# EAGLE design relayChain5 (EAGLE 9.2.2)

## Sheet 1 of 2
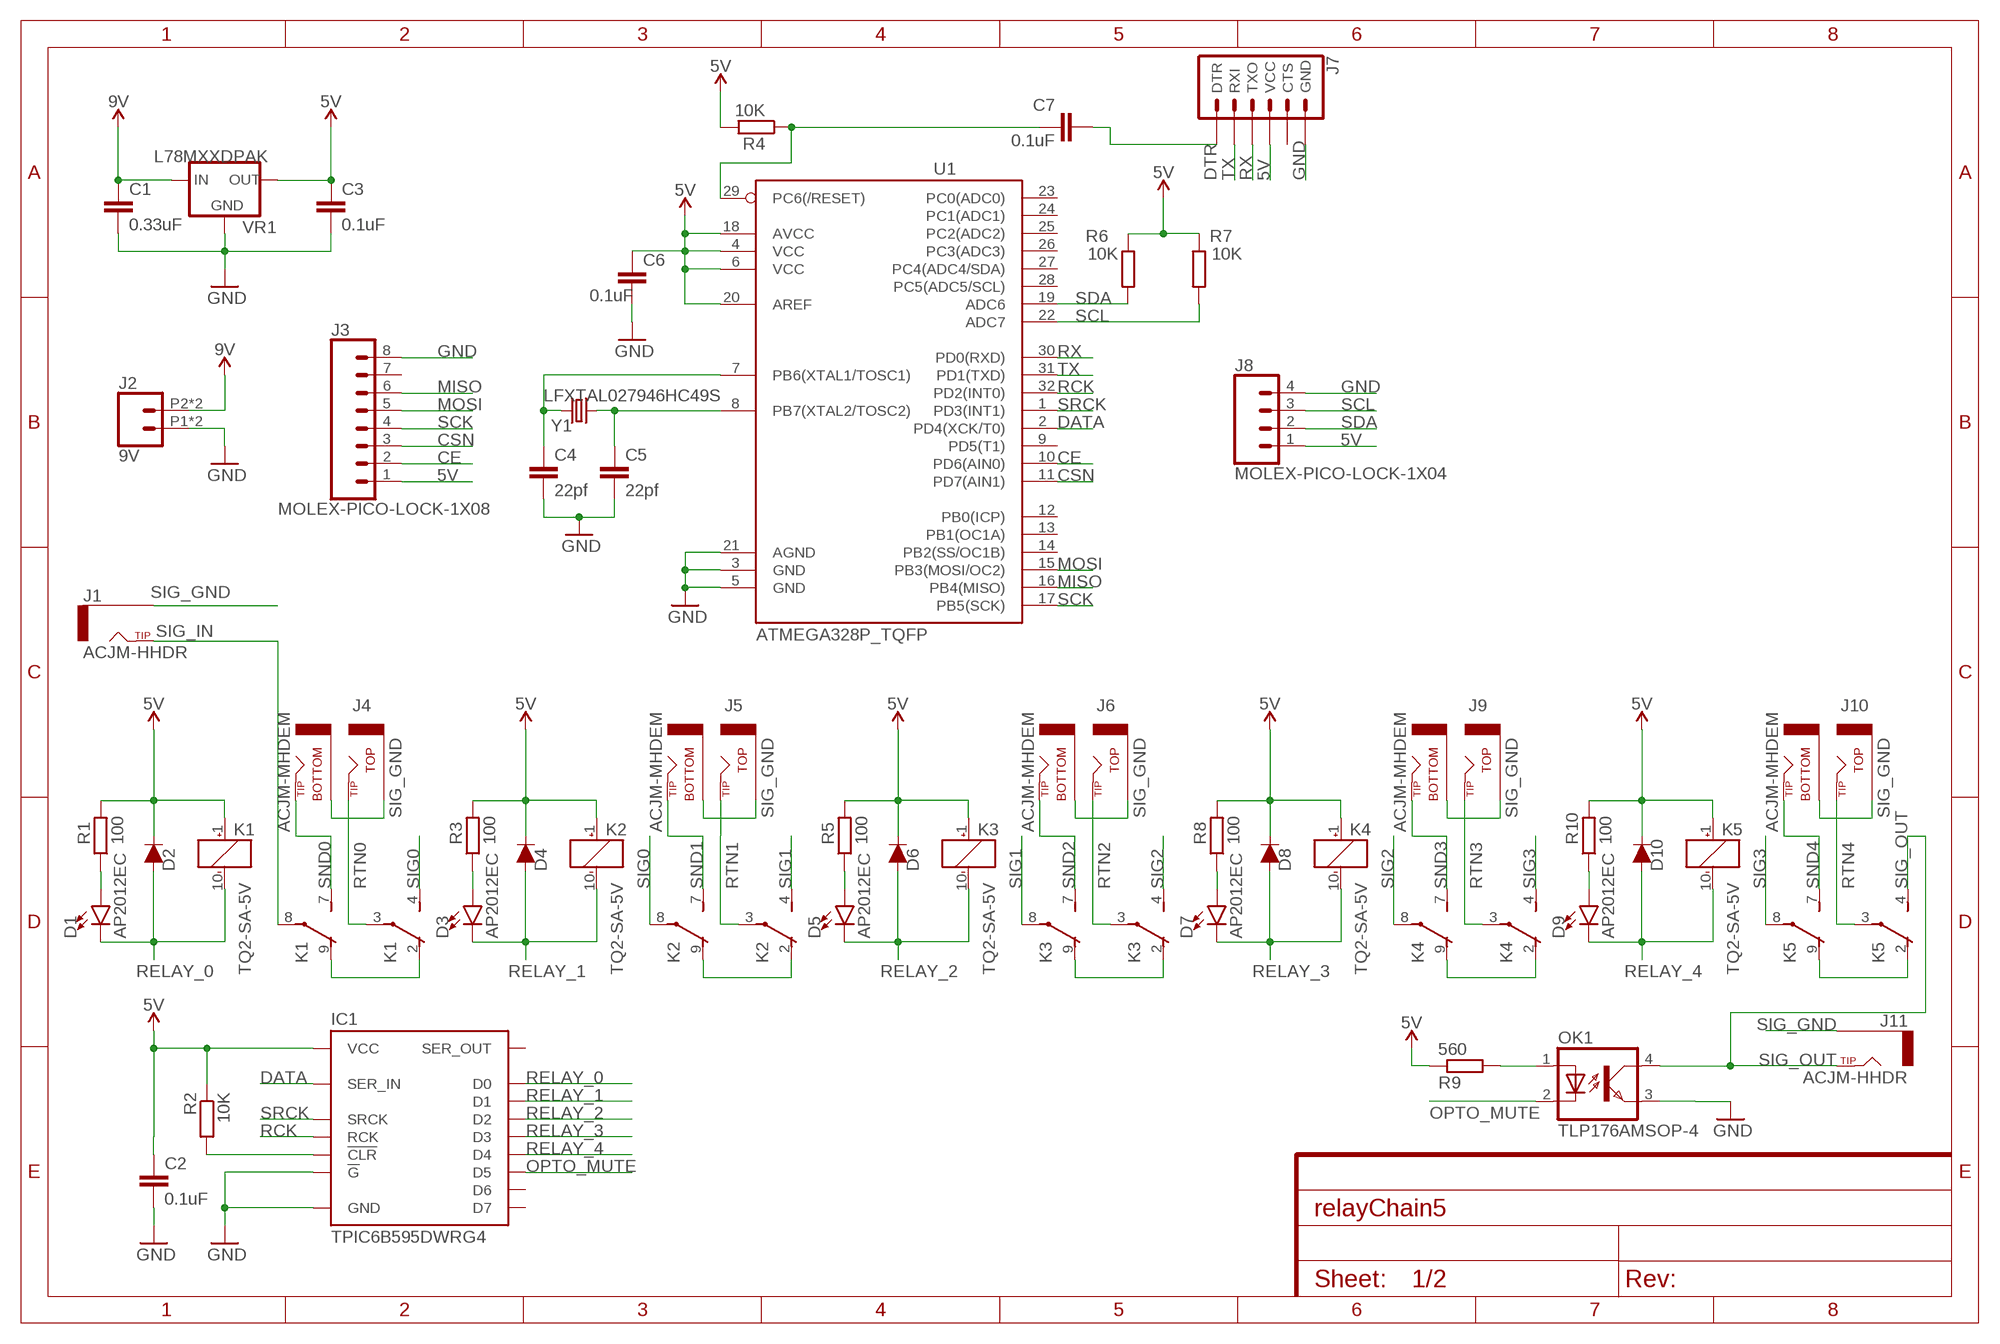
[diagram p0: schematic, sheet 1]

### Parts
C1  0.33uF  C-EUC0805  [C0805]
C2  0.1uF  C-EUC0805  [C0805]
C3  0.1uF  C-EUC0805  [C0805]
C4  22pf  C-EUC0805  [C0805]
C5  22pf  C-EUC0805  [C0805]
C6  0.1uF  C-EUC0805  [C0805]
C7  0.1uF  C-EUC0805  [C0805]
D1  AP2012EC  [0805-LED-AP2012EC]
D2  1n4148  621-1N4148  [SOD-123_MINI-SMA]
D3  AP2012EC  [0805-LED-AP2012EC]
D4  1n4148  621-1N4148  [SOD-123_MINI-SMA]
D5  AP2012EC  [0805-LED-AP2012EC]
D6  1n4148  621-1N4148  [SOD-123_MINI-SMA]
D7  AP2012EC  [0805-LED-AP2012EC]
D8  1n4148  621-1N4148  [SOD-123_MINI-SMA]
D9  AP2012EC  [0805-LED-AP2012EC]
D10  1n4148  621-1N4148  [SOD-123_MINI-SMA]
IC1  TPIC6B595DWRG4  [SOIC127P1032X265-20]
J1  ACJM-HHDR  [ACJM-HHDR]
J2  9V  CONN_02SMALL_POKEHOME  [1X02_POKEHOME]
J3  MOLEX-PICO-LOCK-1X08  [MOLEX-PICO-LOCK-1X08]
J4  ACJM-MHDEM  [ACJM-MHDEM]
J5  ACJM-MHDEM  [ACJM-MHDEM]
J6  ACJM-MHDEM  [ACJM-MHDEM]
J7  6_PIN_SERIAL_TARGETPTH-KIT  [1X06-KIT]
J8  MOLEX-PICO-LOCK-1X04  [MOLEX-PICO-LOCK-1X04]
J9  ACJM-MHDEM  [ACJM-MHDEM]
J10  ACJM-MHDEM  [ACJM-MHDEM]
J11  ACJM-HHDR  [ACJM-HHDR]
K1  TQ2-SA-5V  [TQ-SA]
K2  TQ2-SA-5V  [TQ-SA]
K3  TQ2-SA-5V  [TQ-SA]
K4  TQ2-SA-5V  [TQ-SA]
K5  TQ2-SA-5V  [TQ-SA]
OK1  TLP176AMSOP-4  [SOP254P715X220-4]
R1  100  R-EU_M2012  [M2012]
R2  10K  R-EU_R0805  [R0805]
R3  100  R-EU_M2012  [M2012]
R4  10K  R-EU_M2012  [M2012]
R5  100  R-EU_M2012  [M2012]
R6  10K  R-EU_M2012  [M2012]
R7  10K  R-EU_M2012  [M2012]
R8  100  R-EU_M2012  [M2012]
R9  560  R-EU_R0805  [R0805]
R10  100  R-EU_M2012  [M2012]
U1  ATMEGA328P_TQFP  [TQFP32-08]
VR1  L78MXXDPAK  [TO457P972X240-3]
Y1  LFXTAL027946HC49S  [XTAL1150X490X450]

### Nets
5V: C2.1 C3.1 C6.1 D2.C D4.C D6.C D8.C D10.C IC1.2(VCC) J3.1 J7.4(VCC) J8.1 K1.1(_:+) K2.1(_:+) K3.1(_:+) K4.1(_:+) K5.1(_:+) R1.2 R2.1 R3.2 R4.2 R5.2 R6.1 R7.1 R8.2 R9.1 R10.2 U1.4(VCC) U1.6(VCC) U1.18(AVCC) U1.20(AREF) VR1.2(OUT)
9V: C1.1 J2.P2 J2.P4 VR1.1(IN)
CE: J3.2 U1.10(PD6(AIN0))
CSN: J3.3 U1.11(PD7(AIN1))
DATA: IC1.3(SER_IN) U1.2(PD4(XCK/T0))
DTR: C7.2 J7.1(DTR)
GND: C1.2 C2.2 C3.2 C4.2 C5.2 C6.2 IC1.9(!G) IC1.10(GND) IC1.11(GND) IC1.19(GND) J2.P1 J2.P3 J3.8 J7.6(GND) J8.4 OK1.3(EMIT) U1.3(GND) U1.5(GND) U1.21(AGND) VR1.3(GND)
MISO: J3.6 U1.16(PB4(MISO))
MOSI: J3.5 U1.15(PB3(MOSI/OC2))
N$1: K1.2(1:O) K1.9(2:O)
N$2: IC1.8(!CLR) R2.2
N$3: D1.A R1.1
N$4: K2.2(1:O) K2.9(2:O)
N$5: D3.A R3.1
N$6: K3.2(1:O) K3.9(2:O)
N$7: D5.A R5.1
N$8: K4.2(1:O) K4.9(2:O)
N$9: D7.A R8.1
N$10: K5.2(1:O) K5.9(2:O)
N$11: D9.A R10.1
N$12: OK1.1(A) R9.2
N$17: C4.1 U1.7(PB6(XTAL1/TOSC1)) Y1.1
N$18: C5.1 U1.8(PB7(XTAL2/TOSC2)) Y1.2
N$19: C7.1 R4.1 U1.29(PC6(/RESET))
OPTO_MUTE: IC1.15(D5) OK1.2(C)
RCK: IC1.12(RCK) U1.32(PD2(INT0))
RELAY_0: D1.C D2.A IC1.4(D0) K1.10(_:-)
RELAY_1: D3.C D4.A IC1.5(D1) K2.10(_:-)
RELAY_2: D5.C D6.A IC1.6(D2) K3.10(_:-)
RELAY_3: D7.C D8.A IC1.7(D3) K4.10(_:-)
RELAY_4: D9.C D10.A IC1.14(D4) K5.10(_:-)
RTN0: J4.9(TIP_TOP) J4.12(TIP_TOP) K1.3(1:P)
RTN1: J5.9(TIP_TOP) J5.12(TIP_TOP) K2.3(1:P)
RTN2: J6.9(TIP_TOP) J6.12(TIP_TOP) K3.3(1:P)
RTN3: J9.9(TIP_TOP) J9.12(TIP_TOP) K4.3(1:P)
RTN4: J10.9(TIP_TOP) J10.12(TIP_TOP) K5.3(1:P)
RX: J7.3(TXO) U1.30(PD0(RXD))
SCK: J3.4 U1.17(PB5(SCK))
SCL: J8.3 R7.2 U1.22(ADC7)
SDA: J8.2 R6.2 U1.19(ADC6)
SIG0: K1.4(1:S) K2.8(2:P)
SIG1: K2.4(1:S) K3.8(2:P)
SIG2: K3.4(1:S) K4.8(2:P)
SIG3: K4.4(1:S) K5.8(2:P)
SIG_GND: J1.SLEEVE_1(SLEEVE) J1.SLEEVE_2(SLEEVE) J4.1(SLEEVE_BOTTOM) J4.4(SLEEVE_BOTTOM) J4.7(SLEEVE_TOP) J4.10(SLEEVE_TOP) J5.1(SLEEVE_BOTTOM) J5.4(SLEEVE_BOTTOM) J5.7(SLEEVE_TOP) J5.10(SLEEVE_TOP) J6.1(SLEEVE_BOTTOM) J6.4(SLEEVE_BOTTOM) J6.7(SLEEVE_TOP) J6.10(SLEEVE_TOP) J9.1(SLEEVE_BOTTOM) J9.4(SLEEVE_BOTTOM) J9.7(SLEEVE_TOP) J9.10(SLEEVE_TOP) J10.1(SLEEVE_BOTTOM) J10.4(SLEEVE_BOTTOM) J10.7(SLEEVE_TOP) J10.10(SLEEVE_TOP) J11.SLEEVE_1(SLEEVE) J11.SLEEVE_2(SLEEVE)
SIG_IN: J1.TIP_1(TIP) J1.TIP_2(TIP) K1.8(2:P)
SIG_OUT: J11.TIP_1(TIP) J11.TIP_2(TIP) K5.4(1:S) OK1.4(COL)
SND0: J4.3(TIP_BOTTOM) J4.6(TIP_BOTTOM) K1.7(2:S)
SND1: J5.3(TIP_BOTTOM) J5.6(TIP_BOTTOM) K2.7(2:S)
SND2: J6.3(TIP_BOTTOM) J6.6(TIP_BOTTOM) K3.7(2:S)
SND3: J9.3(TIP_BOTTOM) J9.6(TIP_BOTTOM) K4.7(2:S)
SND4: J10.3(TIP_BOTTOM) J10.6(TIP_BOTTOM) K5.7(2:S)
SRCK: IC1.13(SRCK) U1.1(PD3(INT1))
TX: J7.2(RXI) U1.31(PD1(TXD))
Unconnected: IC1.16(D6) IC1.17(D7) IC1.18(SER_OUT) J3.7 J7.5(CTS) U1.9(PD5(T1)) U1.12(PB0(ICP)) U1.13(PB1(OC1A)) U1.14(PB2(SS/OC1B)) U1.23(PC0(ADC0)) U1.24(PC1(ADC1)) U1.25(PC2(ADC2)) U1.26(PC3(ADC3)) U1.27(PC4(ADC4/SDA)) U1.28(PC5(ADC5/SCL))

## Sheet 2 of 2
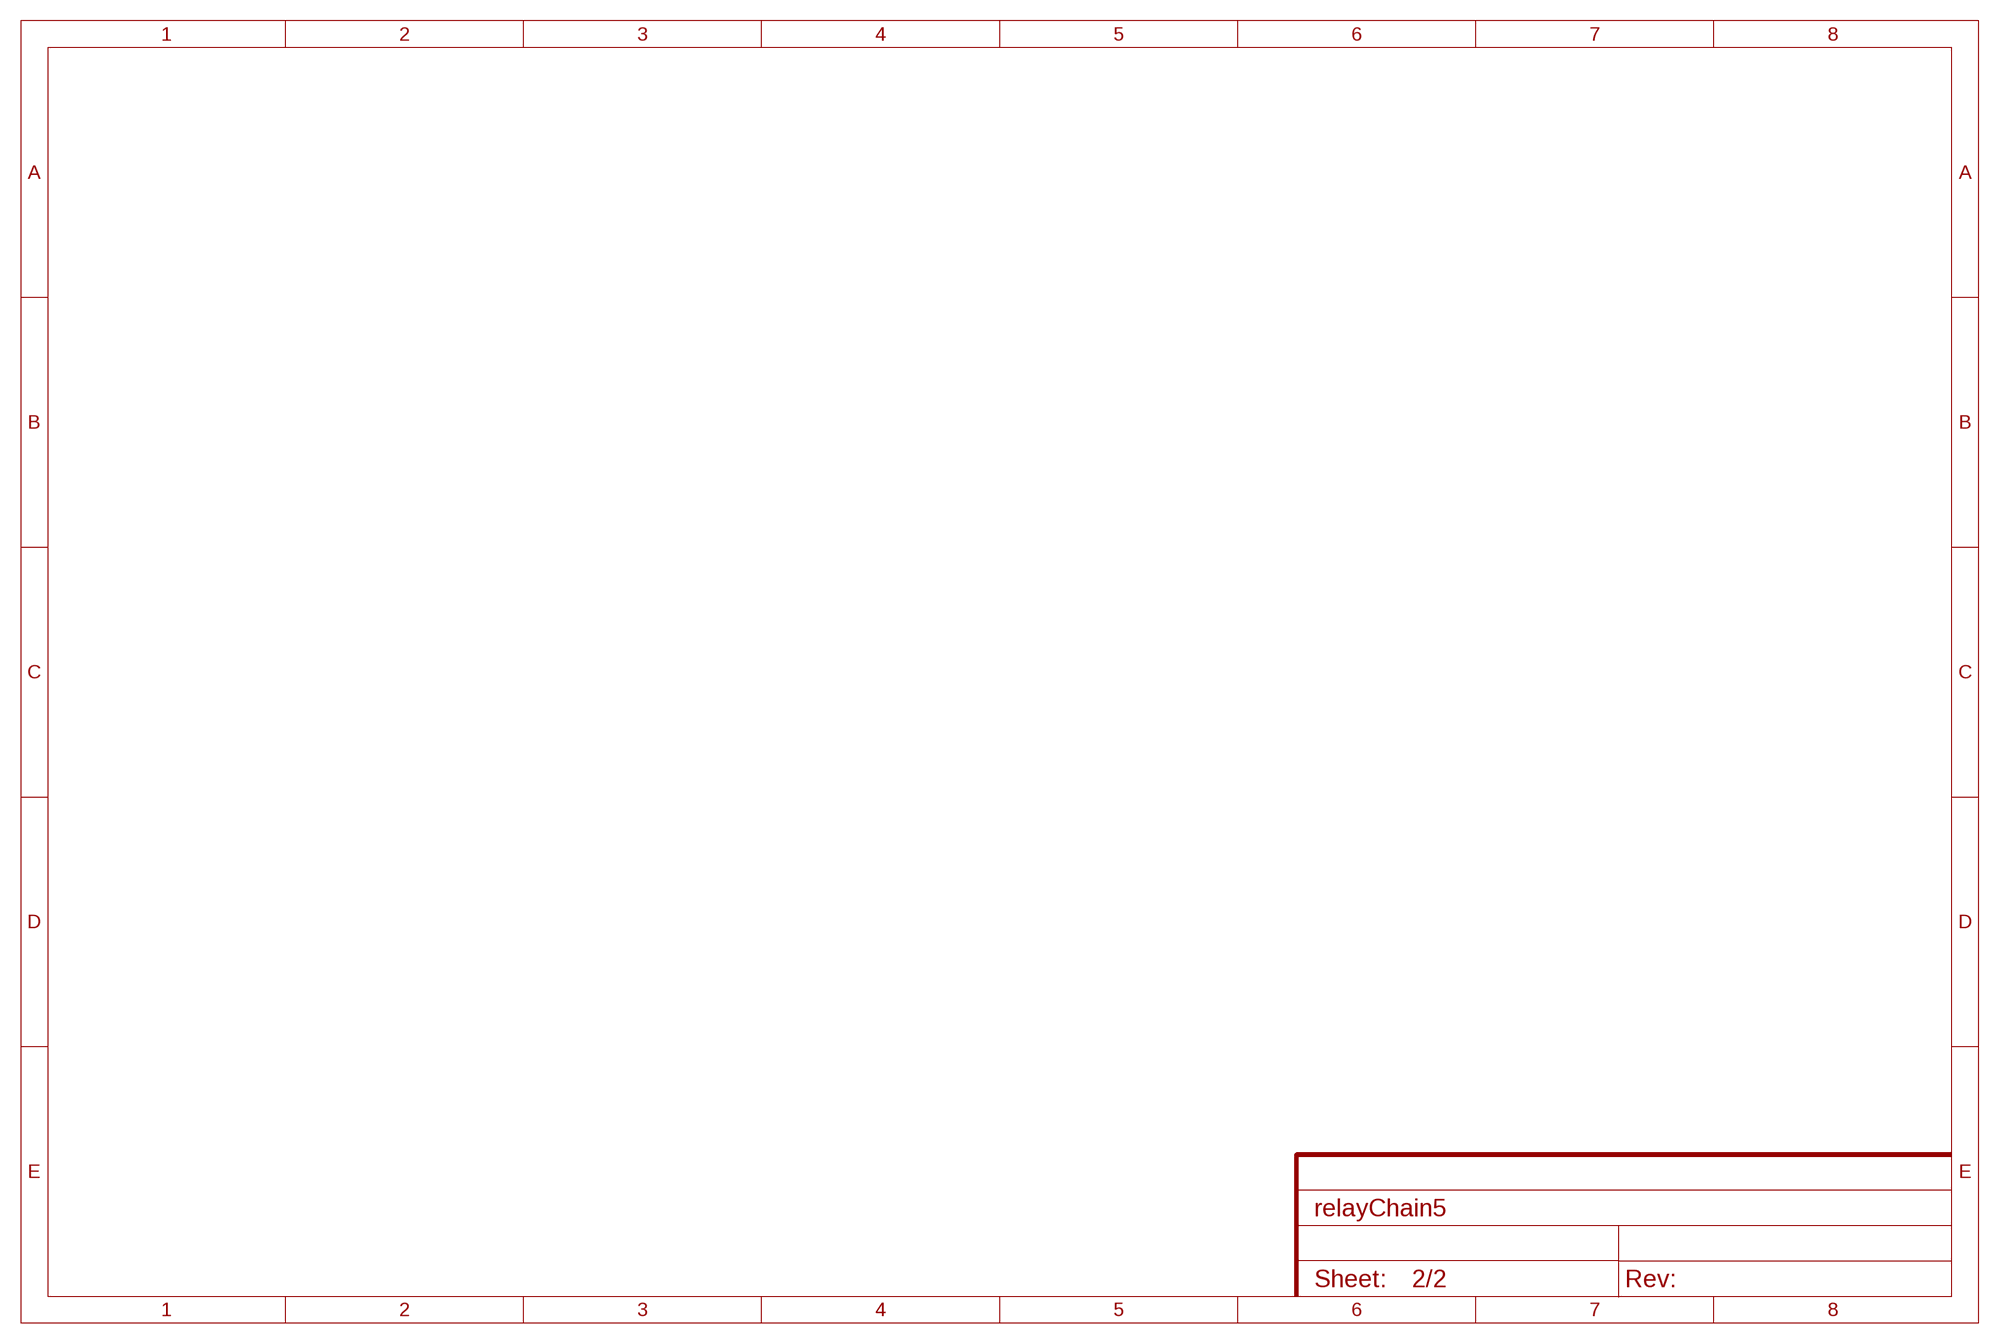
[diagram p1: schematic, sheet 2]

## Library data of the parts
C1-C7 = rcl:C-EU: CAPACITOR, European symbol; SPICEPREFIX: C
D1 D3 D5 D7 D9 = My-SMD-Library:AP2012EC: The High Efficiency Red source color devices are made with Gallium Arsenide Phosphide on Gallium Phosphide Orange Light Emitting Diode.
D2 D4 D6 D8 D10 = My-SMD-Library:621-1N4148?*
IC1 = My-SMD-Library:TPIC6B595DWRG4
J1 J11 = My-SMD-Library:ACJM-HHDR
J2 = SparkFun-Connectors:CONN_02: Multi connection point. Often used as Generic Header-pin footprint for 0.1 inch spaced/style header connections On any of the 0.1 inch spaced packages, you can populate with these: Break Away Headers - Straight <https://www.sparkfun.com/products/116> (PRT-00116) Break Away Male Headers - Right Angle <https://www.sparkfun.com/products/553> (PRT-00553) Female Headers <https://www.sparkfun.com/products/115> (PRT-00115) Break Away Headers - Machine Pin <https://www.sparkfun.com/products/117> (PRT-00117) Break Away Female Headers - Swiss Machine Pin <https://www.sparkfun.com/products/743> (PRT-00743) For SCREWTERMINALS and SPRING TERMINALS visit here: Screw Terimnals on SparkFun.com <https://www.sparkfun.com/search/results?term=Screw+Terminals> (5mm/3.5mm/2.54mm spacing) This device is also useful as a general connection point to wire up your design to another part of your project. Our various solder wires solder well into these plated through hole pads. Hook-Up Wire - Assortment (Stranded, 22 AWG) <https://www.sparkfun.com/products/11375> (PRT-11375) Hook-Up Wire - Assortment (Solid Core, 22 AWG) <https://www.sparkfun.com/products/11367> (PRT-11367) View the entire wire category on our website here <https://www.sparkfun.com/categories/141> Special notes: Molex polarized connector foot print use with: PRT-08233 with associated crimp pins and housings. 2.54_SCREWTERM for use with PRT-10571. 3.5mm Screw Terminal footprints for PRT-08084 5mm Screw Terminal footprints for use with PRT-08432; PROD_ID: CONN-13512
J3 = My-SMD-Library:MOLEX-PICO-LOCK-1X08
J4-J6 J9 J10 = My-SMD-Library:ACJM-MHDEM
J7 = SparkFun-Connectors:6_PIN_SERIAL_TARGET: 6-pin header connection for use with the "FTDI BASIC" pinout - TARGET SIDE. Also known as "Arduino Serial Program Header". It is used to mate with our FTDI Basic serial programmers using the Arduino IDE. Note, this device has "TARGET" in the name. It is intended to be used on a design that contains a target micro-controller that you wish to program. The "sister" device, named "CABLE" is inteneded to be used on a design that usually lives on the end of your USB cable and prvides the converter chip (FTDI232 or FTDI231x) to commnicate serial RX/TX. You can populate with some of these: Break Away Headers - Straight <https://www.sparkfun.com/products/116> (PRT-00116) For reference (or to suit your programming needs) check out these designs: SparkFun FTDI Basic Breakout - 5V <https://www.sparkfun.com/products/9716> (DEV-09716) SparkFun FTDI Basic Breakout - 3.3V <https://www.sparkfun.com/products/9873> (DEV-09873) SparkFun FTDI SmartBasic <https://www.sparkfun.com/products/12935> (DEV-12935) SparkFun Beefy 3 - FTDI Basic Breakout <https://www.sparkfun.com/products/13746> (DEV-13746)
J8 = My-SMD-Library:MOLEX-PICO-LOCK-1X04
K1-K5 = My-SMD-Library:TQ2?*: LOW PROFILE 2 FORM C RELAY NAiS Source: http://www.mew-europe.com/.. en_ds_61020_0001.pdf Source: http://www.mew-europe.com/.. en_ds_61020_0004.pdf; MF: AROMAT/ MATSUSHITA; MPN: TQ2SA-5V; OC_FARNELL: 1124054; OC_NEWARK: 64K3205
OK1 = My-SMD-Library:TLP176AM
R1-R10 = rcl:R-EU_: RESISTOR, European symbol; SPICEPREFIX: R
U1 = SparkFun-IC-Microcontroller:ATMEGA328P_TQFP: Popular 328P in QFP Storefront component: ATmega328 - TQFP <https://www.sparkfun.com/products/13448> (COM-13448) Datasheet <http://www.sparkfun.com/datasheets/Components/SMD/ATMega328.pdf> SparkFun Products SparkFun RedBoard - Programmed with Arduino <https://www.sparkfun.com/products/12757> (DEV-12757) Arduino Pro Mini 328 - 5V/16MHz <https://www.sparkfun.com/products/11113> (DEV-11113) Arduino Pro Mini 328 - 3.3V/8MHz <https://www.sparkfun.com/products/11114> (DEV-11114) SparkFun OpenLog <https://www.sparkfun.com/products/13712> (DEV-13712) SparkFun MicroView - OLED Arduino Module <https://www.sparkfun.com/products/12923> (DEV-12923) SparkFun Digital Sandbox <https://www.sparkfun.com/products/12651> (DEV-12651) SparkFun PicoBoard <https://www.sparkfun.com/products/11888> (WIG-11888) Arduino Fio <https://www.sparkfun.com/products/10116> (DEV-10116) LilyPad Arduino 328 Main Board <https://www.sparkfun.com/products/13342> (DEV-13342) SparkFun RedStick <https://www.sparkfun.com/products/13741> (DEV-13741) LilyPad MP3 <https://www.sparkfun.com/products/11013> (DEV-11013) LilyPad Arduino SimpleSnap <https://www.sparkfun.com/products/10941> (DEV-10941) SparkFun Stepoko <https://www.sparkfun.com/products/13899> (ROB-13899) SparkFun Geiger Counter <https://www.sparkfun.com/products/11345> (SEN-11345) SparkFun EL Sequencer <https://www.sparkfun.com/products/12781> (COM-12781) Arduino Pro 328 - 5V/16MHz <https://www.sparkfun.com/products/10915> (DEV-10915) CryptoCape <https://www.sparkfun.com/products/12773> (DEV-12773) SparkFun IR Thermometer Evaluation Board - MLX90614 <https://www.sparkfun.com/products/10740> (SEN-10740) SparkFun RedBot Mainboard <https://www.sparkfun.com/products/12097> (ROB-12097) Arduino Pro 328 - 3.3V/8MHz <https://www.sparkfun.com/products/10914> (DEV-10914) SparkFun Block for Intel® Edison - Arduino <https://www.sparkfun.com/products/13036> (DEV-13036) SparkFun Simon Says - Surface Mount Soldering Kit <https://www.sparkfun.com/products/10935> (KIT-10935) SparkFun 7-Segment Serial Display - Red <https://www.sparkfun.com/products/11441> (COM-11441) SparkFun 7-Segment Serial Display - White <https://www.sparkfun.com/products/11629> (COM-11629) SparkFun 7-Segment Serial Display - Yellow <https://www.sparkfun.com/products/11443> (COM-11443) SparkFun 7-Segment Serial Display - Kelly Green <https://www.sparkfun.com/products/11440> (COM-11440) SparkFun 7-Segment Serial Display - Blue <https://www.sparkfun.com/products/11442> (COM-11442) SparkFun OpenSegment Serial Display - 20mm (Blue) <https://www.sparkfun.com/products/11647> (COM-11647) SparkFun OpenSegment Serial Display - 20mm (Green) <https://www.sparkfun.com/products/11646> (COM-11646) SparkFun OpenSegment Serial Display - 20mm (White) <https://www.sparkfun.com/products/11648> (COM-11648) SparkFun OpenSegment Serial Display - 20mm (Red) <https://www.sparkfun.com/products/11644> (COM-11644) SparkFun OpenSegment Serial Display - 20mm (Yellow) <https://www.sparkfun.com/products/11645> (COM-11645) SparkFun OpenSegment Shield <https://www.sparkfun.com/products/13190> (DEV-13190); PROD_ID: IC-09069
VR1 = My-SMD-Library:L78MXX?*
Y1 = My-SMD-Library:LFXTAL027946

## Board
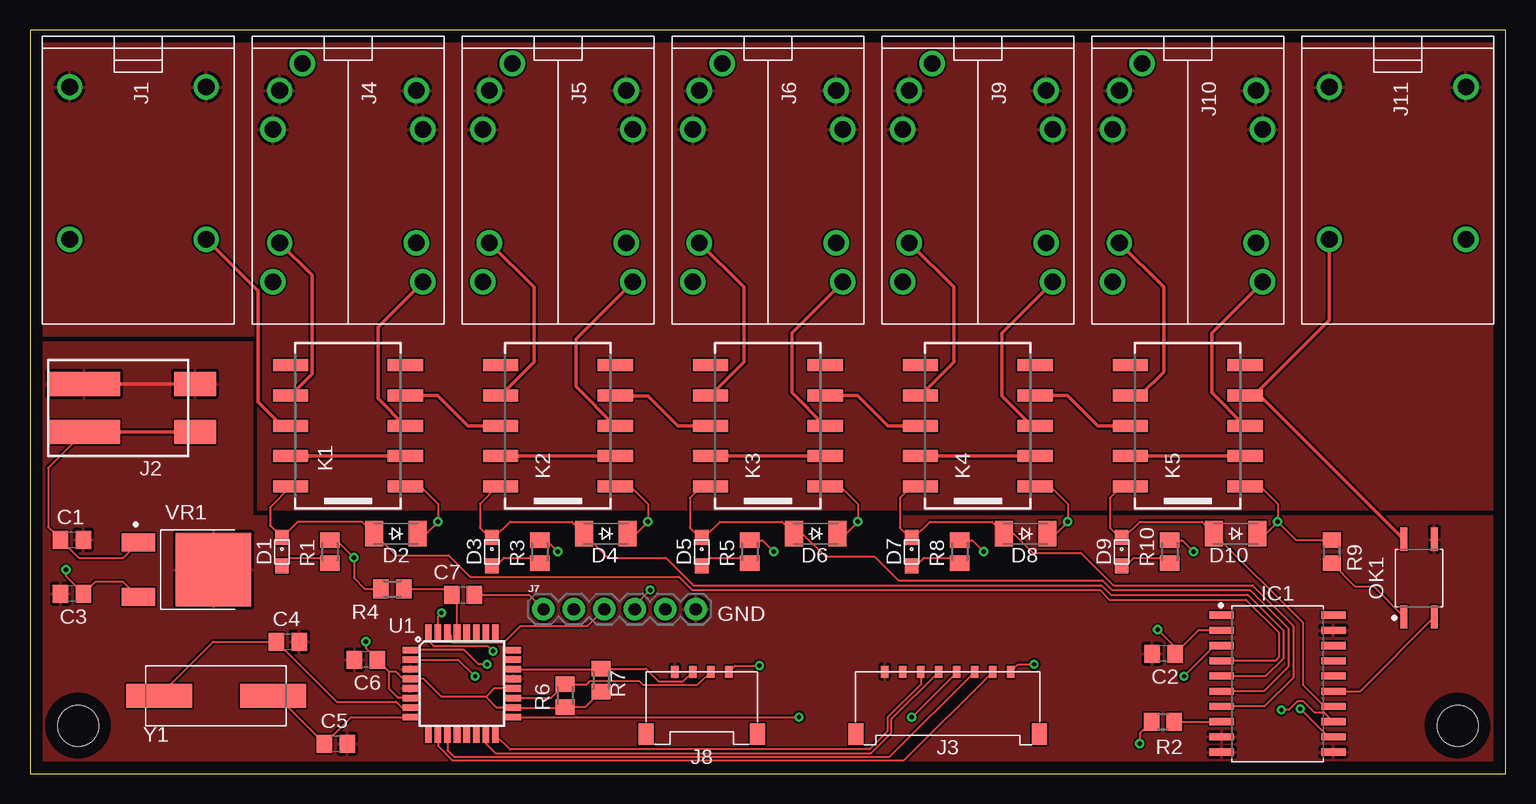
[diagram p2: board, top side]
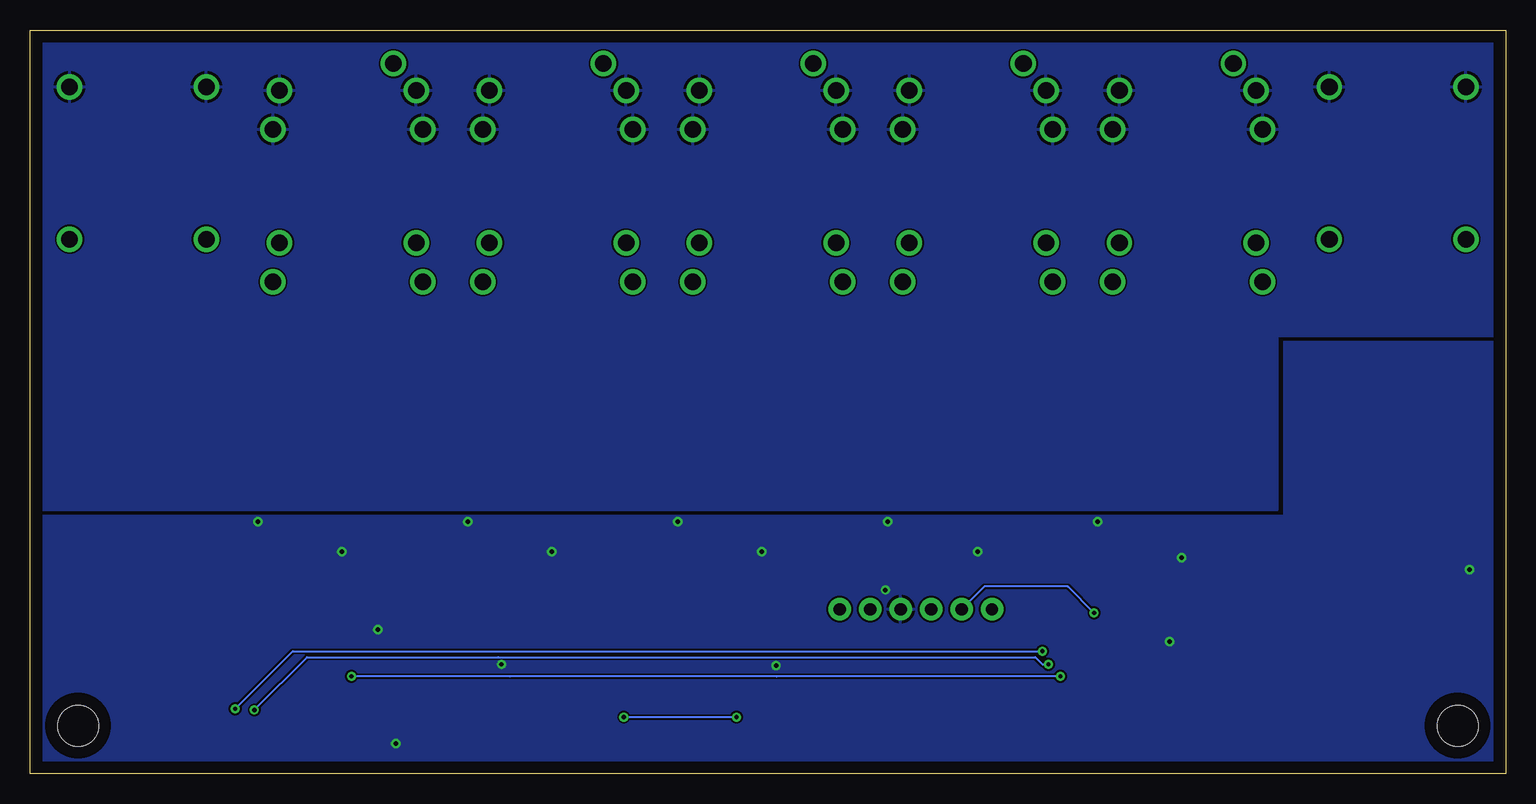
[diagram p3: board, bottom side, seen from below]

Size 123 x 62 mm. Coordinates in mm from the lower left corner, seen from the top.
Outline: 0,0 123,0 123,62 0,62 0,0
Copper layers (1*16): Top 0.035mm / dielectric 1.5mm / Bottom 0.035mm
Design rules "default": minimum track width 6mil, minimum drill 0.35mm, track to track 6mil, track to pad 6mil, pad to pad 6mil, via to via 6mil, smd to smd 6mil, copper to edge 40mil, drill to drill 6mil, minimum pad ring 10mil, minimum via ring 8mil, stop-mask expansion 4mil, vias tented up to drill 0mil, thermal gap 10mil
Holes 3.4 mm at 4,4 119,4

### Footprints (pad centres in the part's own frame; a part is rotated, then mirrored left to right if it is on the bottom)
C0805 = smd 1.3 x 1.5: 1 -0.95,0; 2 0.95,0
0805-LED-AP2012EC = smd 1.25 x 1.1: A -1.175,0; C 1.175,0
SOD-123_MINI-SMA = smd 1.5 x 2.1: A 1.8,0; C -1.8,0
SOIC127P1032X265-20 = smd 2.052 x 0.602: 1 -4.654,5.715; 2 -4.654,4.445; 3 -4.654,3.175; 4 -4.654,1.905; 5 -4.654,0.635; 6 -4.654,-0.635; 7 -4.654,-1.905; 8 -4.654,-3.175; 9 -4.654,-4.445; 10 -4.654,-5.715; 11 4.654,-5.715; 12 4.654,-4.445; 13 4.654,-3.175; 14 4.654,-1.905; 15 4.654,-0.635; 16 4.654,0.635; 17 4.654,1.905; 18 4.654,3.175; 19 4.654,4.445; 20 4.654,5.715
ACJM-HHDR = drill 1.4: SLEEVE_1 4.25,2.3; SLEEVE_2 4.25,13.7; TIP_1 16.95,2.3; TIP_2 16.95,13.7
1X02_POKEHOME = smd 3.5 x 2: P1 5.25,2; P2 5.25,-2 | smd 6 x 2: P3 -4,2; P4 -4,-2
MOLEX-PICO-LOCK-1X08 = smd 0.6 x 1: 1 -5.25,0; 2 -3.75,0; 3 -2.25,0; 4 -0.75,0; 5 0.75,0; 6 2.25,0; 7 3.75,0; 8 5.25,0 | smd 1.25 x 1.8: S1 -7.65,5.2; S2 7.65,5.2
ACJM-MHDEM = drill 1.4: 1 4.55,13.7; 3 17.25,13.7; 4 4.55,2.3; 6 17.25,2.3; 7 7.8,14.25; 9 20.5,14.25; 10 7.8,1.75; 12 20.5,1.75; E 2.3,4.2
1X06-KIT = drill 1.016 pad 1.88: 1 0,0; 2 2.54,0; 3 5.08,0; 4 7.62,0; 5 10.16,0; 6 12.7,0
MOLEX-PICO-LOCK-1X04 = smd 0.6 x 1: 1 -2.25,0; 2 -0.75,0; 3 0.75,0; 4 2.25,0 | smd 1.25 x 1.8: S1 -4.65,5.2; S2 4.65,5.2
TQ-SA = smd 1 x 2.94: 1 -5.08,-4.78; 2 -2.54,-4.78; 3 0,-4.78; 4 2.54,-4.78; 5 5.08,-4.78; 6 5.08,4.78; 7 2.54,4.78; 8 0,4.78; 9 -2.54,4.78; 10 -5.08,4.78
SOP254P715X220-4 = smd 1.925 x 0.602: 1 -3.24,1.27; 2 -3.24,-1.27; 3 3.24,-1.27; 4 3.24,1.27
M2012 = smd 1.3 x 1.6: 1 -0.95,0; 2 0.95,0
R0805 = smd 1.3 x 1.5: 1 -0.95,0; 2 0.95,0
TQFP32-08 = smd 1.27 x 0.559: 1 -4.293,2.8; 2 -4.293,2; 3 -4.293,1.2; 4 -4.293,0.4; 5 -4.293,-0.4; 6 -4.293,-1.2; 7 -4.293,-2; 8 -4.293,-2.8; 17 4.293,-2.8; 18 4.293,-2; 19 4.293,-1.2; 20 4.293,-0.4; 21 4.293,0.4; 22 4.293,1.2; 23 4.293,2; 24 4.293,2.8 | smd 0.559 x 1.27: 9 -2.8,-4.293; 10 -2,-4.293; 11 -1.2,-4.293; 12 -0.4,-4.293; 13 0.4,-4.293; 14 1.2,-4.293; 15 2,-4.293; 16 2.8,-4.293; 25 2.8,4.293; 26 2,4.293; 27 1.2,4.293; 28 0.4,4.293; 29 -0.4,4.293; 30 -1.2,4.293; 31 -2,4.293; 32 -2.8,4.293
TO457P972X240-3 = smd 2.8 x 1.5: 1 -3.95,2.286; 2 -3.95,-2.286 | smd 6.3 x 6.1: 3 2.3,0
XTAL1150X490X450 = smd 5.5 x 2: 1 -4.75,0; 2 4.75,0

### Placement (x,y rotation side)
C1  3.5,19.5 0 top
C2  94.5,10 180 top
C3  3.5,15 180 top
C4  21.5,11 0 top
C5  25.5,2.5 0 top
C6  28,9.5 180 top
C7  36.1,14.9 0 top
D1  21,18.5 90 top
D2  30.5,20 180 top
D3  38.5,18.5 90 top
D4  48,20 180 top
D5  56,18.5 90 top
D6  65.5,20 180 top
D7  73.5,18.5 90 top
D8  83,20 180 top
D9  91,18.5 90 top
D10  100.5,20 180 top
IC1  104,7.5 0 top
J1  1,61.5 270 top
J2  8.5,30.5 0 top
J3  76.5,8.5 180 top
J4  18.5,61.5 270 top
J5  36,61.5 270 top
J6  53.5,61.5 270 top
J7  42.8,13.7 0 top
J8  56,8.5 180 top
J9  71,61.5 270 top
J10  88.5,61.5 270 top
J11  106,61.5 270 top
K1  26.5,29 90 top
K2  44,29 90 top
K3  61.5,29 90 top
K4  79,29 90 top
K5  96.5,29 90 top
OK1  115.8,16.3 90 top
R1  25,18.5 90 top
R2  94.44,4.33 0 top
R3  42.5,18.5 90 top
R4  30.2,15.4 180 top
R5  60,18.5 90 top
R6  44.6,6.5 90 top
R7  47.6,7.8 90 top
R8  77.5,18.5 90 top
R9  108.5,18.5 270 top
R10  95,18.5 90 top
U1  36,7.5 0 top
VR1  13,17 0 top
Y1  15.5,6.5 0 top

### Tracks (layer width: path | path; a pad name or v marks a point on that pad's centre or on a via)
5V  (via drill 0.35)
  Top 0.152: VR1.2 7.76,16 5.45,16 C3.1 3,16.45 v3,17 | U1.6 30.7,6.3 29.95,7.05 29.95,8.5 | 29.95,8.5 C6.1 28,10.45 v28,11 | 29.95,8.5 30.5,8.5 31.1,7.9 U1.4 32.8,7.9 34.3,6.4 38,6.4 | K1.1 31.28,23.72 32.78,23.72 34,22.5 v34,21 33,20 D2.C | R1.2 25.55,19.45 v27,18 27,16.3 27.9,15.4 R4.2 | R3.2 43.05,19.45 v44,18.5 | 51.5,21.2 v51.5,21 | D4.C 50.5,20 v51.5,21 | K2.1 50.08,23.92 51.5,22.5 v51.5,21 | R5.2 61.05,19.45 v62,18.5 | K3.1 67.58,23.92 69,22.5 v69,21 68,20 D6.C | K4.1 85.08,23.92 86.5,22.5 v86.5,21 85.5,20 D8.C | R8.2 78.55,19.45 v79.5,18.5 | R10.2 96.05,19.45 v97,18.5 | K5.1 102.58,23.92 104,22.5 v104,21 | v104,21 103,20 D10.C | R9.1 105.55,19.45 v104,21 | IC1.2 97.39,11.95 C2.1 95.45,10.55 v94,12 | R2.1 92.5,3.34 v92.5,2.5 | J7.4 50.42,14.02 v51.7,15.3 | J3.1 82.35,9.1 v83.7,9.1 | J8.1 58.75,9 v60.8,9 | 38,6.4 38.9,5.5 U1.18 44.55,5.5 R6.1 46.3,5.55 R7.1 | U1.20 38.7,7.1 38,6.4
  pour Bottom: 0.5,36 18.5,36 18.5,21.5 122.5,21.5 122.5,0.5 0.5,0.5
9V
  Top 0.152: J2.P4 1.5,25.5 1.5,20.55 C1.1 4.05,18 7.76,18 VR1.1
  Top 0.305: J2.P4 J2.P2
CE
  Top 0.152: U1.10 34,2.3 35.21,1.09 72.84,1.09 J3.2
CSN
  Top 0.152: U1.11 34.8,1.93 35.33,1.4 71.65,1.4 J3.3
DATA  (via drill 0.35)
  Top 0.152: IC1.3 98.78,10.68 v96.2,8.1 | U1.2 35.7,9.5 v37.1,8.1
  Bottom 0.152: v37.1,8.1 60.76,8.1 83,8.1 v96.2,8.1
DTR
  Top 0.152: C7.2 41.6,14.9 J7.1
GND
  Top 0.305: J2.P3 J2.P1
  pour Top: 0.5,36 18.5,36 18.5,21.5 122.5,21.5 122.5,0.5 0.5,0.5
MISO
  Top 0.152: J3.6 74.25,7.43 71.5,4.68 71.5,3.53 69.98,2.01 40,2.01 U1.16
MOSI
  Top 0.152: U1.15 38,2.5 38.8,1.7 70.1,1.7 71.8,3.4 71.8,4.55 J3.5
N$1
  Top 0.305: K1.9 K1.2
N$2
  Top 0.152: R2.2 IC1.8
N$3
  Top 0.152: D1.A 21.68,18 24.55,18 R1.1
N$4
  Top 0.305: K2.9 K2.2
N$5
  Top 0.152: D3.A 38.83,17.32 39.5,18 42.05,18 R3.1
N$6
  Top 0.305: K3.9 K3.2
N$7
  Top 0.152: D5.A 56.67,18 59.55,18 R5.1
N$8
  Top 0.305: K4.9 K4.2
N$9
  Top 0.152: D7.A 73.83,17.32 74.5,18 77.05,18 R8.1
N$10
  Top 0.305: K5.9 K5.2
N$11
  Top 0.152: D9.A 91.33,17.32 92,18 94.55,18 R10.1
N$12
  Top 0.152: R9.2 110.45,15.6 112,15.6 OK1.1
N$17
  Top 0.152: Y1.1 15.25,11 C4.1 25.55,6 30.5,6 31,5.5 U1.7
N$18
  Top 0.152: U1.8 26.75,4.7 C5.1 20.55,6.5 Y1.2
N$19
  Top 0.152: R4.1 34.65,15.4 C7.1 35.6,14.45 U1.29
OPTO_MUTE
  Top 0.152: IC1.15 110.88,6.87 OK1.2
RCK  (via drill 0.35)
  Top 0.152: IC1.12 108.25,3.06 v105.9,5.4 | v38.6,10.2 38.2,10.6 33.7,10.6 33.2,11.1 U1.32
  Bottom 0.152: v105.9,5.4 101.1,10.2 v38.6,10.2
RELAY_0
  Top 0.152: K1.10 20,22.2 20,20.68 D1.C 22.32,21 27.7,21 D2.A 30.5,18.2 34.9,18.2 36.7,16.4 54.1,16.4 55.2,15.3 89.17,15.3 89.97,14.49 101.37,14.49 104.08,11.78 104.08,9.68 103.8,9.4 IC1.4
RELAY_1
  Top 0.152: K2.10 38.92,23.92 37.5,22.5 37.5,20.5 38.33,19.68 D3.C 38.67,19.68 40,21 45.2,21 D4.A 48.2,18 53,18 55.3,15.7 89.31,15.7 90.1,14.9 101.5,14.9 104.5,11.9 104.5,9.61 103.03,8.13 IC1.5
RELAY_2
  Top 0.152: K3.10 55.92,23.92 55,23 55,20.5 55.83,19.68 D5.C 56.17,19.68 57.5,21 62.7,21 D6.A 64.4,20 66.3,18.1 70.4,18.1 72.4,16.1 89.4,16.1 90.2,15.3 101.7,15.3 104.9,12.1 104.9,8.9 102.86,6.87 IC1.6
RELAY_3
  Top 0.152: K4.10 73.42,23.92 72.5,23 72.5,20.5 73.33,19.68 D7.C 73.67,19.68 75,21 80.2,21 D8.A 82,20 83.6,18.4 87.6,18.4 90.3,15.7 101.9,15.7 105.3,12.3 105.3,8 102.89,5.59 IC1.7
RELAY_4
  Top 0.152: D9.C 91.17,19.68 | 91.17,19.68 92.5,21 97.7,21 D10.A 106.1,12.6 106.1,7.4 107.91,5.59 IC1.14 | K5.10 90.92,23.92 90,23 90,20.5 90.83,19.68 91.17,19.68
RTN0
  Top 0.305: J4.9 29,37.25 29,31.28 K1.3
RTN1
  Top 0.305: J5.9 45.5,36.25 45.5,32.28 K2.3
RTN2
  Top 0.305: J6.9 63.5,36.75 63.5,31.78 K3.3
RTN3
  Top 0.305: J9.9 81,36.75 81,31.5 83.5,29 K4.3
RTN4
  Top 0.305: J10.9 100.12,38.38 98.5,36.75 98.5,31.78 K5.3
RX
  Top 0.152: U1.30 35.09,11.5 35.09,11.06 35.23,10.93 39.53,10.93 40.9,12.3 46.48,12.3 J7.3
SCK  (via drill 0.35)
  Top 0.152: U1.17 43.68,4.7 43.7,4.67 45.49,4.67 45.52,4.7 v64.1,4.7 | v73.5,4.7 77.25,8.45 J3.4
  Bottom 0.152: v64.1,4.7 v73.5,4.7
SCL
  Top 0.152: U1.22 47.55,8.7 R7.2 51.35,8.75 52.4,7.71 54.45,7.71 J8.3
SDA
  Top 0.152: U1.19 43.45,6.3 R6.2 46.43,7.45 46.7,7.73 50.77,7.73 51.1,7.4 55.65,7.4 J8.2
SIG0
  Top 0.305: K1.4 33.96,31.54 36.5,29 K2.8
SIG1
  Top 0.305: K2.4 48.82,31.5 51.5,31.5 54,29 K3.8
SIG2
  Top 0.305: K4.8 71.5,29 68.96,31.54 K3.4
SIG3
  Top 0.305: K4.4 86.46,31.54 89,29 K5.8
SIG_GND
  pour Top: 0.5,61.5 122.5,61.5 122.5,22 19,22 19,36.5 0.5,36.5
  pour Bottom: 0.5,61.5 122.5,61.5 122.5,22 19,22 19,36.5 0.5,36.5
SIG_IN
  Top 0.305: J1.TIP_2 19,40.25 19,31 21,29 K1.8
SIG_OUT
  Top 0.305: J11.TIP_1 108.3,37.8 102.04,31.54 K5.4 102.53,31.54 OK1.4
SND0
  Top 0.305: J4.6 23.5,41.55 23.5,33.32 K1.7
SND1
  Top 0.305: J5.6 42,40.55 42,34.32 K2.7
SND2
  Top 0.305: J6.6 59.5,40.55 59.5,34.32 K3.7
SND3
  Top 0.305: J9.6 77,40.55 77,34.32 K4.7
SND4
  Top 0.305: J10.6 94.5,40.55 94.5,33.5 92.54,31.54 K5.7
SRCK  (via drill 0.35)
  Top 0.152: IC1.13 107.91,5.07 107.09,5.07 106.15,6.01 105.65,6.01 104.94,5.3 v104.3,5.3 | v38.1,9.1 37.4,9.1 36.2,10.29 U1.1
  Bottom 0.152: v104.3,5.3 99.9,9.7 83.96,9.7 83.95,9.71 39.21,9.71 38.6,9.1 v38.1,9.1
TX  (via drill 0.35)
  Top 0.152: U1.31 34,13.1 v34.3,13.4
  Bottom 0.152: v34.3,13.4 36.5,15.6 43.44,15.6 J7.2

### Text on the board
tNames: GND
tValues: +9V